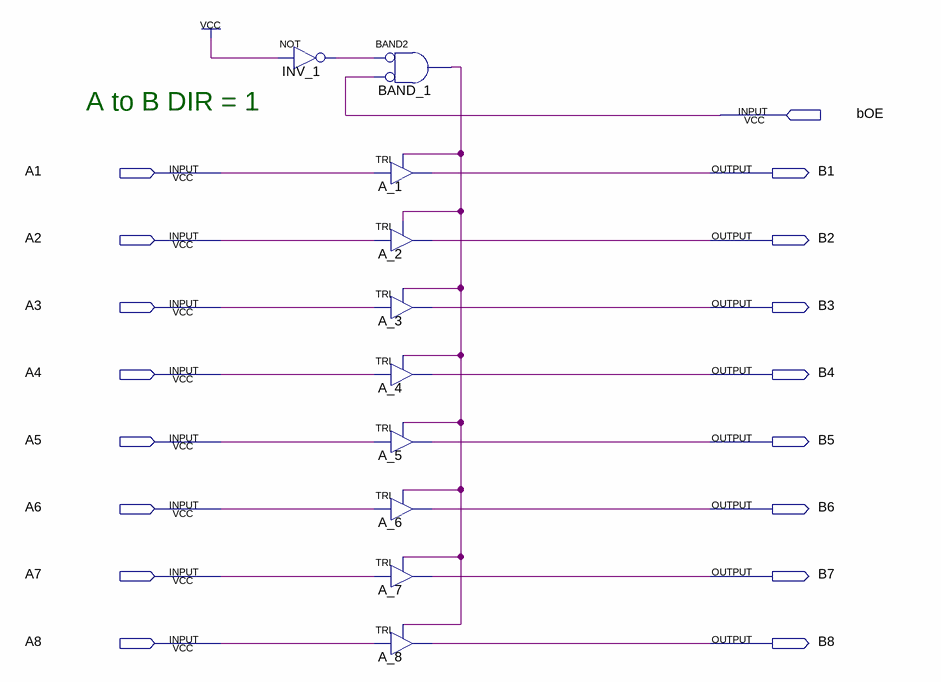
[diagram p0: schematic sheet]
// Quartus schematic IC_74LS245AB_RTL.bdf as structural Verilog: 10 symbols, 17 pins
module IC_74LS245AB_RTL (
  input  bOE,
  input  A1,
  input  A2,
  input  A3,
  input  A4,
  input  A5,
  input  A6,
  input  A7,
  input  A8,
  output B1,
  output B2,
  output B3,
  output B4,
  output B5,
  output B6,
  output B7,
  output B8
);

  wire BAND_1_out, INV_1_out;

  not INV_1 (INV_1_out, 1'b1);
  and BAND_1 (BAND_1_out, ~INV_1_out, ~bOE);  // BAND2
  TRI A_1 (.IN(A1), .OE(BAND_1_out), .OUT(B1));
  TRI A_2 (.IN(A2), .OE(BAND_1_out), .OUT(B2));
  TRI A_3 (.IN(A3), .OE(BAND_1_out), .OUT(B3));
  TRI A_4 (.IN(A4), .OE(BAND_1_out), .OUT(B4));
  TRI A_5 (.IN(A5), .OE(BAND_1_out), .OUT(B5));
  TRI A_6 (.IN(A6), .OE(BAND_1_out), .OUT(B6));
  TRI A_7 (.IN(A7), .OE(BAND_1_out), .OUT(B7));
  TRI A_8 (.IN(A8), .OE(BAND_1_out), .OUT(B8));

  // Notes on the sheet:
  //   A to B DIR = 1
endmodule
